# EAGLE design working (EAGLE 9.3.2)
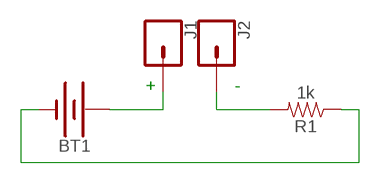
[diagram p0: schematic, sheet 1]

## Parts
BT1  BATTERY-20MM_SMD_4LEGS  [BATTCON_20MM_4LEGS]
J1  CONN_01  [1X01]
J2  CONN_01  [1X01]
R1  1k  1KOHM-HORIZ-1/4W-1%  [AXIAL-0.3]

## Nets
N$1: BT1.POSITIVE@1(+) BT1.POSITIVE@2(+) BT1.POSITIVE@3(+) BT1.POSITIVE@4(+) J1.1
N$2: J2.1 R1.P$2
N$3: BT1.NEGATIVE(-) R1.P$1

## Notes on the sheet
- + | -

## Library data of the parts
BT1 = SparkFun-Batteries:BATTERY: Battery - Single Cell A variety of battery chemistries, sizes, and footprints. Device List: 20MM_PTH - Coin Cell Battery Holder - 20mm (PTH) <https://www.sparkfun.com/products/783> 20MM_PTH_KIT- Coin Cell battery Holder - 20 mm (PTH) <http://www.sparkfun.com/products/783>kit version with special mask 6.8MM_PTH - Coin Cell Battery Holder - 6.8MM(SMD) <https://www.digikey.com/product-detail/en/seiko-instruments/MS621FE-FL11E/728-1057-ND/1889208?WT.srch=1&gclid=CNOQ5a6LzdQCFZS2wAodXCkE0g> 12MM_SMD - Coin Cell Battery Holder - 12mm (SMD) <https://www.sparkfun.com/products/10592> 12MM_PTH - Coin Cell Battery Holder - 12mm (PTH) <https://www.sparkfun.com/products/7948> 20MM_SMD - 20mm Coin Cell Battery Holder (SMD) (2 legs) Used on the Big Time Watch Kit <https://www.sparkfun.com/products/11734> 20MM_SMD_4LEGS - Coin Cell Battery Holder - 20mm (SMD) <https://www.sparkfun.com/products/11892> 20MM_SMD_4LEGS_OVERPASTE - Coin Cell Battery Holder - 20mm (SMD) <https://www.sparkfun.com/products/11892> (Over-paste on the legs) 24.5MM_PTH - Coin Cell Battery Holder - 24.5mm (PTH) <https://www.sparkfun.com/products/8863> 9V - 9V Battery Holder - PC Mount Used on the SparkFun SparkPunk Sound Kit <https://www.sparkfun.com/products/11177> and SparkFun SparkPunk Sequencer Kit <https://www.sparkfun.com/products/12707> 18650 - Battery Holder - 18650 (PTH) <https://www.sparkfun.com/products/13113> AA - Battery Holder - 1xAA (PTH) <https://www.sparkfun.com/products/7949> AAA - Battery Holder - 1xAAA (PTH) <https://www.sparkfun.com/products/12718> AA_KIT - Battery Holder - 1xAA (PTH) <https://www.sparkfun.com/products/7949> Special kit package - pads only have exposed copper on one side of the board. AAA_KIT - Battery Holder - 1xAAA (PTH) <https://www.sparkfun.com/products/12718> Special kit package - pads only have exposed copper on one side of the board.; PROD_ID: BATT-10373; SF_SKU: PRT-11892
J1 J2 = SparkFun-Connectors:CONN_01: Single connection point. Often used as Generic Header-pin footprint for 0.1 inch spaced/style header connections On any of the 0.1 inch spaced packages, you can populate with these: Break Away Headers - Straight <https://www.sparkfun.com/products/116> (PRT-00116) Break Away Male Headers - Right Angle <https://www.sparkfun.com/products/553> (PRT-00553) Female Headers <https://www.sparkfun.com/products/115> (PRT-00115) Break Away Headers - Machine Pin <https://www.sparkfun.com/products/117> (PRT-00117) Break Away Female Headers - Swiss Machine Pin <https://www.sparkfun.com/products/743> (PRT-00743) This device is also useful as a general connection point to wire up your design to another part of your project. Our various solder wires solder well into these plated through hole pads. Hook-Up Wire - Assortment (Stranded, 22 AWG) <https://www.sparkfun.com/products/11375> (PRT-11375) Hook-Up Wire - Assortment (Solid Core, 22 AWG) <https://www.sparkfun.com/products/11367> (PRT-11367) View the entire wire category on our website here <https://www.sparkfun.com/categories/141> Special notes: SMTSO-256-ET is a "flush mount" nut for a 4-40 screw. We mostly use this on specialty testbeds; it is a nice way to connect hardware to your PCB at an adjustable hieght. Also note, the SNAP packages are for using a snappable style connector. We sell a baggie of snaps and they are also used on two LilyPad designs: Snap Assortment - 30 pack (male and female) <https://www.sparkfun.com/products/11347> (DEV-11347) LilyPad Arduino SimpleSnap <https://www.sparkfun.com/products/10941> (DEV-10941) LilyPad SimpleSnap Protoboard <https://www.sparkfun.com/products/10940> (DEV-10940)
R1 = SparkFun-Resistors:1KOHM: 1kΩ resistor A resistor is a passive two-terminal electrical component that implements electrical resistance as a circuit element. Resistors act to reduce current flow, and, at the same time, act to lower voltage levels within circuits. - Wikipedia; PROD_ID: RES-12182

## Board
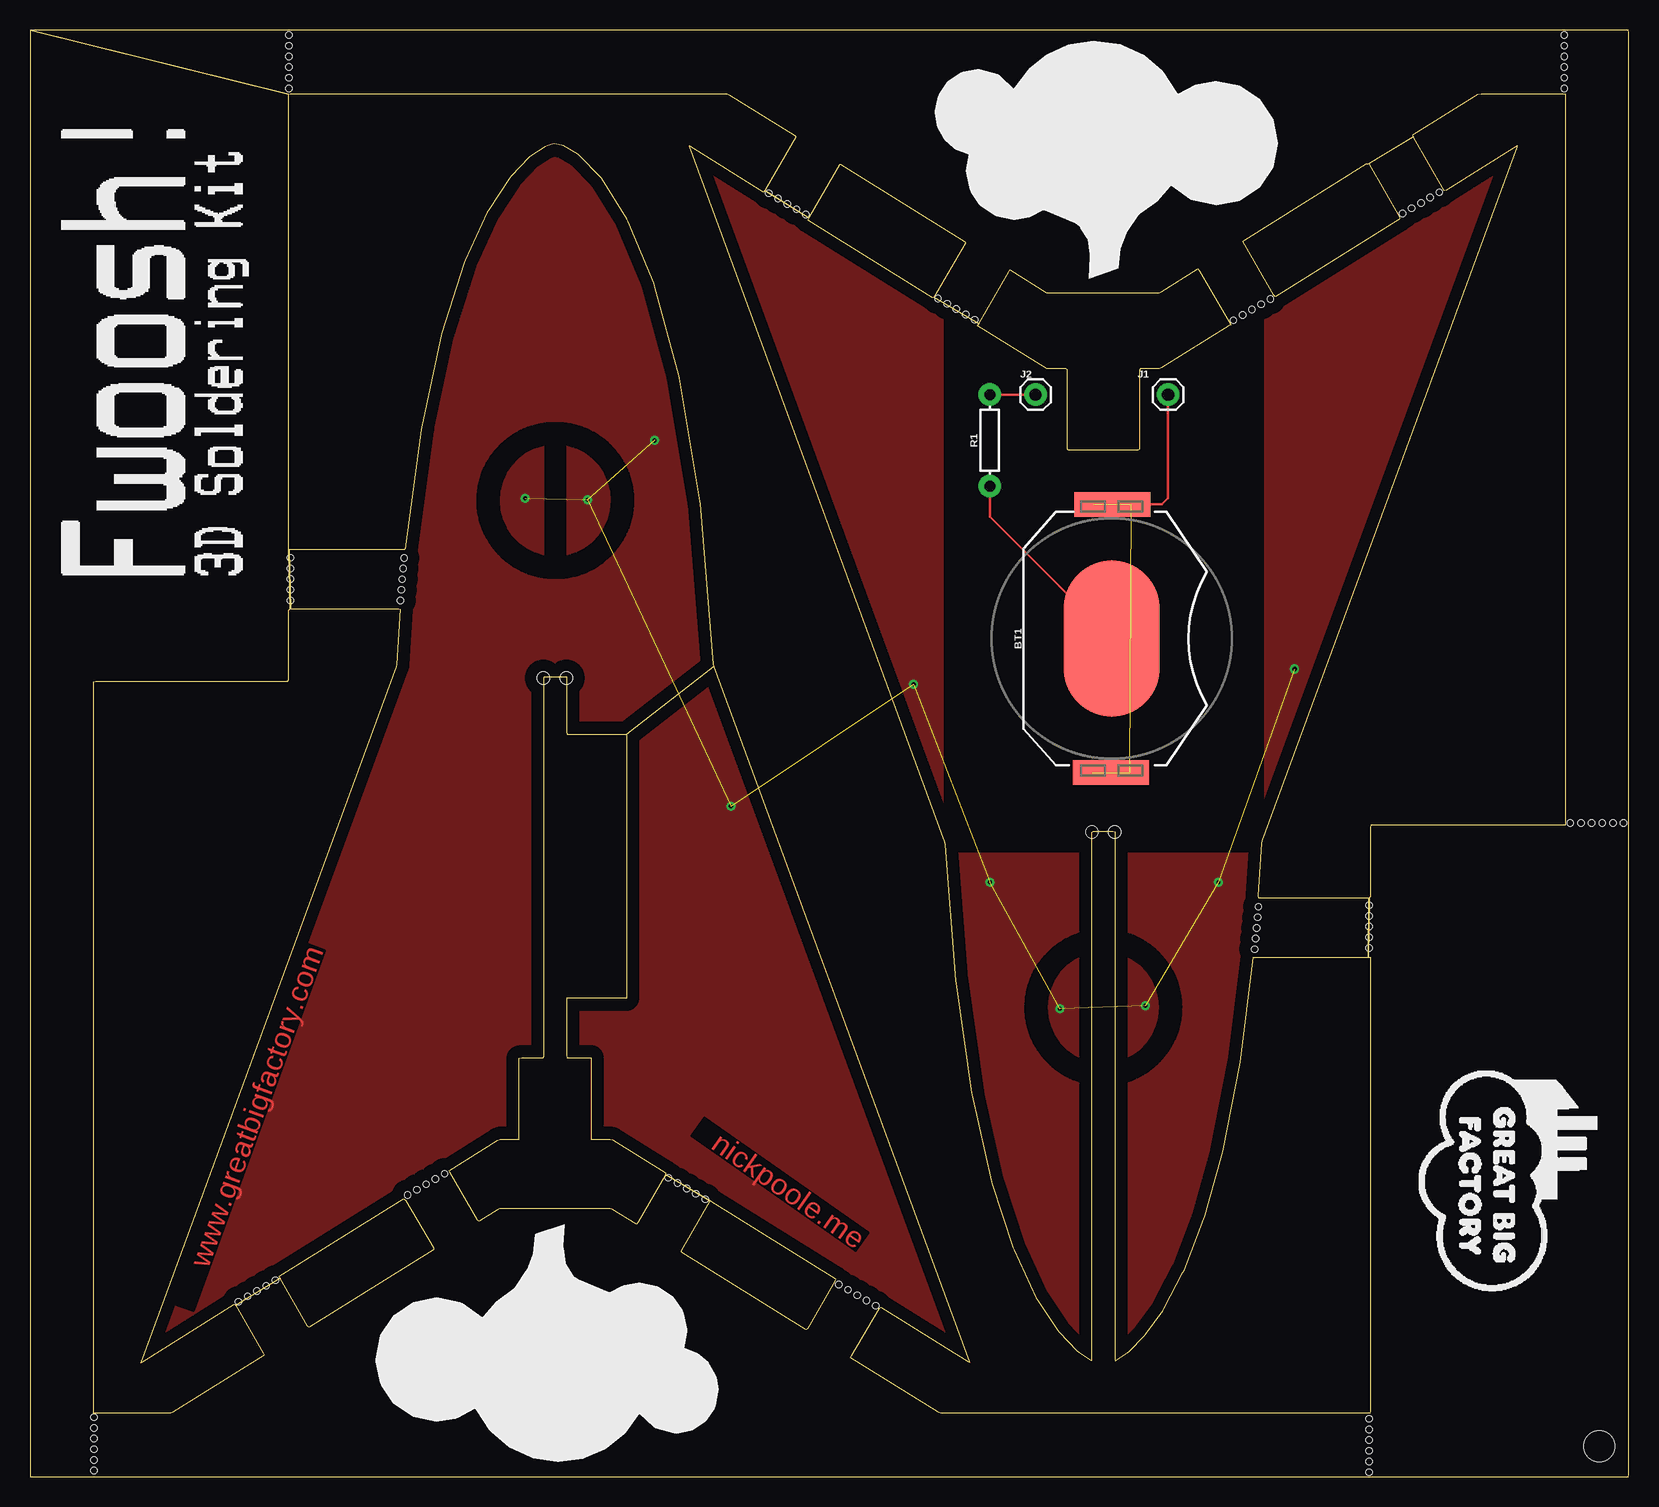
[diagram p1: board, top side]
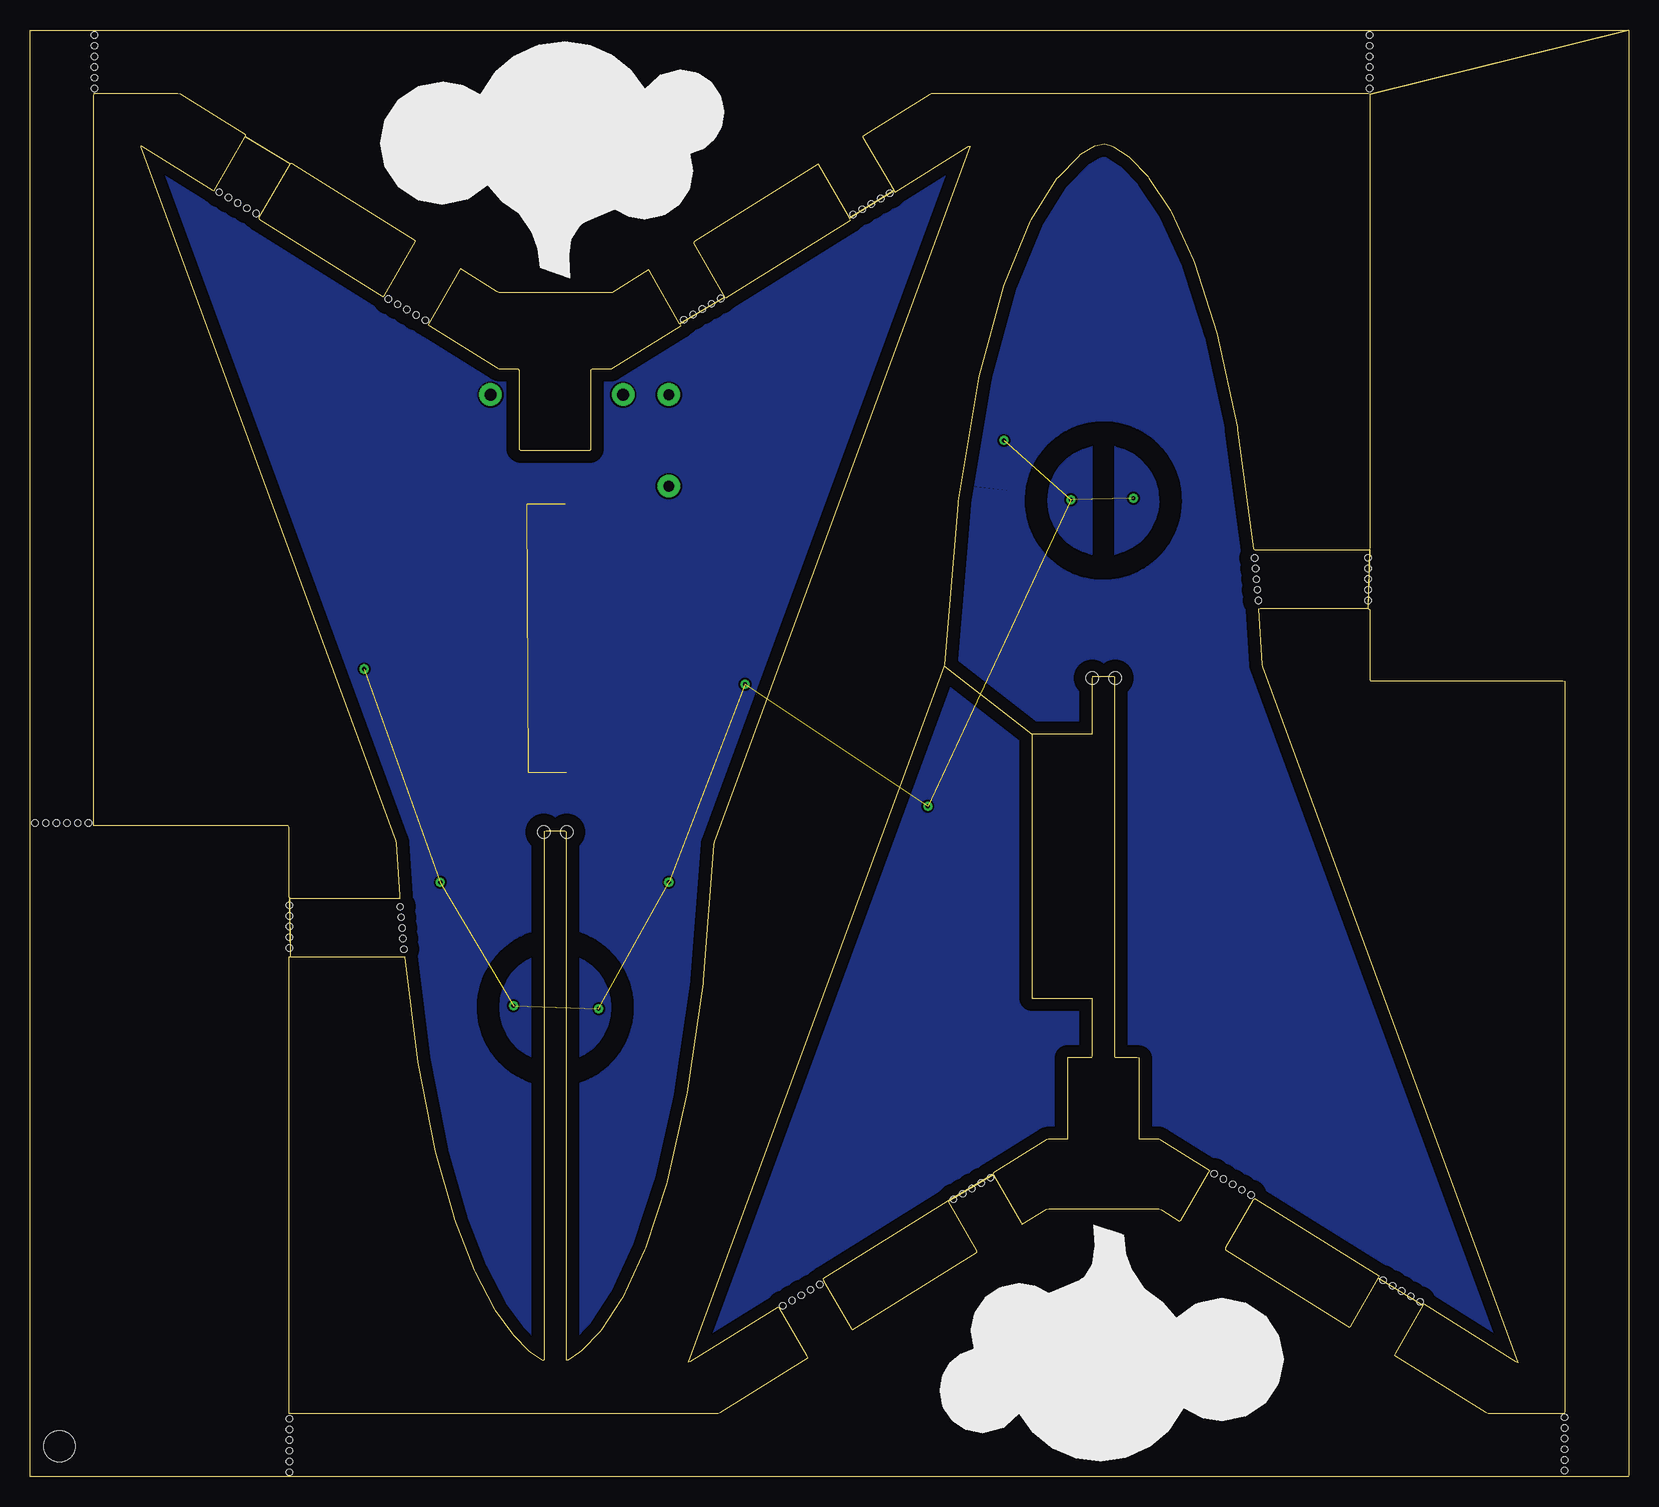
[diagram p2: board, bottom side, seen from below]

Size 133.26 x 120.56 mm. Coordinates in mm from the lower left corner, seen from the top.
Outline: 0,120.56 0,0.16 0.04,0 133.24,0 133.26,0.18 133.26,120.38 133.24,120.56 0.05,120.56 21.56,115.23 21.71,115.27 58.11,115.27 58.28,115.18 63.71,111.79 63.85,111.68 61.26,107.19 64.94,104.9 67.53,109.39 67.57,109.39 77.92,102.93 77.96,102.8 75.37,98.3 79.1,96.1 81.59,100.42 81.69,100.58 84.75,98.68 84.94,98.66 94.14,98.66 94.31,98.75 97.37,100.66 97.49,100.52 100.09,96.01 99.93,95.91 94.33,92.41 94.16,92.31 93.96,92.32 92.56,92.32 92.47,92.21 92.47,85.61 92.36,85.52 86.56,85.52 86.47,85.63 86.47,92.23 86.36,92.32 84.77,92.32 79,95.91 79.09,96.07 75.35,98.29 75.22,98.27 64.87,104.72 64.93,104.87 61.24,107.17 61.14,107.05 55.03,110.86 54.92,110.89 76.24,52.88 76.27,52.68 77.15,41.32 77.17,41.12 78.48,32.01 78.51,31.82 80.14,24.6 80.19,24.4 81.94,19.09 82.01,18.9 83.87,14.91 83.98,14.74 85.63,12.23 85.75,12.08 87.27,10.48 87.43,10.37 88.42,9.69 88.52,9.71 88.52,53.71 88.65,53.77 90.25,53.77 90.42,53.74 90.42,9.74 90.49,9.67 91.49,10.33 91.64,10.47 92.92,11.74 93.03,11.9 94.43,13.85 94.54,14.02 96.12,17.03 96.21,17.21 97.87,21.5 97.92,21.69 99.43,27.08 99.48,27.28 100.86,34.34 100.89,34.54 101.99,43.27 102.16,43.31 111.54,43.31 111.61,48.22 102.42,48.22 102.41,48.4 102.68,52.79 102.74,52.98 123.99,110.8 123.99,110.91 118.05,107.2 117.9,107.16 115.3,111.65 111.59,109.42 114.18,104.92 114.16,104.78 103.81,98.33 103.7,98.44 101.1,102.94 101.22,103.06 111.4,109.41 111.57,109.42 115.3,111.68 115.27,111.82 120.7,115.2 120.96,115.27 127.96,115.27 127.97,115.08 127.97,54.28 127.78,54.27 111.78,54.27 111.72,54.13 111.72,48.33 111.63,48.23 111.57,43.31 111.72,43.27 111.72,5.47 111.69,5.29 75.89,5.29 75.71,5.36 68.41,9.9 68.5,10.07 70.8,14.06 70.92,14.13 78.22,9.58 78.35,9.52 57.03,67.52 49.74,61.87 49.74,40.09 49.73,39.89 44.93,39.89 44.74,39.88 44.74,35.09 44.76,34.91 46.76,34.91 46.79,34.73 46.79,28.13 46.96,28.11 48.36,28.11 48.55,28.08 52.96,25.32 52.97,25.19 56.72,22.98 56.79,22.94 67.14,16.48 67.1,16.32 64.8,12.34 64.68,12.23 54.33,18.68 54.31,18.83 56.7,22.98 52.97,25.17 50.67,21.2 50.57,21.03 48.53,22.3 48.34,22.33 39.14,22.33 38.97,22.25 37.44,21.3 37.31,21.36 35.01,25.34 34.92,25.51 38.99,28.05 39.17,28.11 40.77,28.11 40.79,28.29 40.79,34.89 40.97,34.91 42.77,34.91 42.84,35.04 42.84,66.64 42.91,66.66 44.71,66.66 44.74,66.48 44.74,62.09 44.75,61.89 49.55,61.89 49.73,61.88 57.03,67.54 56.99,67.73 55.88,81.08 55.85,81.28 54.16,91.54 54.12,91.73 52.07,99.26 52.01,99.45 49.85,104.62 49.77,104.8 47.64,108.19 47.51,108.34 45.84,110.06 45.69,110.19 44.48,110.91 44.3,110.97 43.9,111.03 43.71,111.06 43.51,111.02 43.13,110.91 42.94,110.85 41.77,110.09 41.62,109.96 40.09,108.37 39.97,108.21 38.21,105.54 38.12,105.36 36.28,101.37 36.2,101.18 34.31,95.28 32.63,87.46 32.6,87.26 31.29,77.34 31.17,77.25 21.59,77.25 21.73,72.34 30.71,72.34 30.86,72.29 30.58,67.69 30.54,67.5 9.22,9.49 9.39,9.6 17.02,14.36 17.14,14.29 20.85,16.55 20.79,16.7 31.14,23.16 31.33,23.05 33.63,19.07 33.63,18.92 23.27,12.47 23.15,12.56 20.86,16.53 17.16,14.28 19.45,10.3 19.53,10.13 11.89,5.37 11.72,5.29 5.32,5.29 5.29,5.47 5.29,66.27 5.47,66.29 21.47,66.29 21.54,66.41 21.54,72.21 21.7,72.33 21.57,77.26 21.54,77.42 21.54,115.21 0.03,120.56 0,120.56
Copper layers (1*16): Top 0.035mm / dielectric 1.5mm / Bottom 0.035mm
Design rules "default": minimum track width 6mil, minimum drill 0.35mm, track to track 6mil, track to pad 6mil, pad to pad 6mil, via to via 6mil, smd to smd 6mil, copper to edge 40mil, drill to drill 6mil, minimum pad ring 10mil, minimum via ring 8mil, stop-mask expansion 4mil, vias tented up to drill 0mil, thermal gap 10mil
Holes 0.51 mm at 5.33,4.95 5.33,4.06 5.33,3.17 5.33,2.29 5.33,1.4 5.33,0.51 127.89,120.14 127.89,119.25 127.89,118.36 127.89,117.47 127.89,116.59 127.89,115.7 111.63,4.83 111.63,3.94 111.63,3.05 111.63,2.16 111.63,1.27 111.63,0.38 21.59,120.14 21.59,119.25 21.59,118.36 21.59,117.47 21.59,116.59 21.59,115.7 21.72,73.03 21.72,73.91 21.72,74.8 21.72,75.69 21.72,76.58 111.63,44.07 111.63,44.96 111.63,45.85 111.63,46.74 111.63,47.62 102.4,47.5 102.32,46.62 102.25,45.73 102.17,44.84 102.09,43.96 30.87,73.02 30.95,73.91 31.03,74.8 31.1,75.68 31.18,76.57 64.66,105.17 63.89,105.62 63.12,106.06 62.35,106.51 61.58,106.95 17.38,14.59 18.15,15.03 18.92,15.48 19.69,15.92 20.46,16.37 31.48,23.48 32.25,23.92 33.02,24.37 33.79,24.81 34.56,25.26 100.31,96.38 101.08,96.82 101.85,97.26 102.62,97.71 103.39,98.15 114.41,105.27 115.18,105.71 115.95,106.15 116.72,106.6 117.49,107.04 56.28,23.13 55.51,23.58 54.74,24.02 53.97,24.46 53.2,24.91 70.51,14.24 69.74,14.69 68.97,15.13 68.2,15.57 67.43,16.02 78.76,96.41 77.99,96.85 77.22,97.3 76.45,97.74 75.68,98.19 128.4,54.48 129.29,54.48 130.18,54.48 131.06,54.48 131.95,54.48 132.84,54.48
Holes 2.59 mm at 130.81,2.54
Holes 1.02 mm at 44.7,66.55 42.8,66.55 90.42,53.72 88.52,53.72

### Footprints (pad centres in the part's own frame; a part is rotated, then mirrored left to right if it is on the bottom)
BATTCON_20MM_4LEGS = smd 13 x 8: NEGATIVE 0,0 | smd 2.032 x 3.175: POSITIVE@1 -11.176,1.651; POSITIVE@2 -11.176,-1.524; POSITIVE@3 11.176,1.524; POSITIVE@4 11.176,-1.651
1X01 = drill 1.016 pad 1.88: 1 0,0
AXIAL-0.3 = drill 0.9 pad 1.88: P$1 -3.81,0; P$2 3.81,0

### Placement (x,y rotation side)
BT1  90.17,69.85 90 top
J1  94.87,90.17 0 top
J2  83.82,90.17 0 top
R1  80.01,86.36 90 top
U$1  [TEXT1466#PNG]  10.16,97.79 90 top
U$2  [GREATBIGFACTORYCLOUDLOGO#PNG]  123.19,24.51 270 top

### Tracks (layer width: path | path; a pad name or v marks a point on that pad's centre or on a via)
GND  (via drill 0.35)  (9 unrouted)
  other vias: 41.27,81.53 46.48,81.41 85.85,38.99 92.96,39.24 52.07,86.36 58.42,55.88 73.66,66.04 105.41,67.31 99.06,49.53 80.01,49.53
  pour Top (rank 3): 43.69,111.07 43.63,111.07 43.58,111.06 43.53,111.05 43.42,111.03 43.37,111.02 43.27,110.99 43.17,110.95 43.03,110.89 42.88,110.83 42.74,110.75 42.6,110.68 42.47,110.6 42.33,110.51 42.2,110.42 42.07,110.33 41.9,110.2 41.78,110.11 41.61,109.97 41.49,109.87 41.33,109.73 41.18,109.58 41.03,109.43 40.88,109.28 40.77,109.17 40.63,109.01 40.49,108.85 40.35,108.7 40.21,108.53 40.08,108.37 39.91,108.16 39.78,107.99 39.66,107.82 39.53,107.65 39.38,107.44 39.26,107.26 39.11,107.04 39,106.87 38.85,106.64 38.71,106.42 38.6,106.24 38.47,106.01 38.34,105.78 38.21,105.55 38.08,105.32 37.95,105.08 37.83,104.85 37.71,104.62 37.59,104.38 37.47,104.14 37.34,103.86 37.11,103.38 37,103.13 36.88,102.84 36.65,102.31 36.52,102.02 36.41,101.72 36.19,101.18 35.97,100.59 35.75,99.99 35.63,99.64 35.53,99.34 35.41,98.99 35.29,98.64 35.18,98.28 35.07,97.93 34.94,97.53 34.84,97.17 34.73,96.81 34.62,96.41 34.49,95.95 34.36,95.49 34.17,94.77 34.06,94.31 33.93,93.8 33.75,93.03 33.63,92.51 33.51,91.99 33.33,91.17 33.16,90.34 32.99,89.45 32.88,88.88 32.78,88.31 32.62,87.42 32.46,86.48 32.3,85.49 32.15,84.5 32.01,83.5 31.87,82.45 31.74,81.4 31.61,80.35 31.48,79.25 31.36,78.09 31.24,76.93 31.14,75.77 31.03,74.56 30.96,73.66 30.87,72.45 30.78,71.18 30.72,70.28 30.65,68.96 30.58,67.64 30.57,67.59 9.23,9.53 9.23,9.5 39.1,28.12 39.15,28.11 40.79,28.1 40.79,28.16 40.79,34.88 40.81,34.91 42.82,34.91 42.84,34.95 42.84,66.64 42.88,66.66 44.73,66.66 44.74,66.62 44.74,61.91 44.78,61.89 49.7,61.89 49.74,61.88 49.74,39.92 49.71,39.89 44.79,39.89 44.74,39.89 44.74,34.91 44.79,34.91 46.74,34.91 46.79,34.9 46.79,28.12 46.82,28.1 48.46,28.11 48.51,28.1 78.33,9.51 78.35,9.5 57.02,67.57 57,67.62 56.93,69.05 56.85,70.37 56.79,71.32 56.69,72.69 56.59,73.96 56.52,74.85 56.41,76.07 56.3,77.28 56.18,78.49 56.09,79.33 55.96,80.43 55.82,81.59 55.69,82.63 50.37,82.02 50.38,81.88 50.39,81.72 50.4,81.56 50.4,81.35 50.4,81.19 50.4,81.03 50.39,80.87 50.37,80.71 50.36,80.56 50.33,80.35 50.3,80.19 50.27,80.03 50.24,79.88 50.2,79.72 50.16,79.57 50.12,79.42 50.07,79.27 50.02,79.12 49.96,78.97 49.9,78.82 49.82,78.63 49.75,78.48 49.68,78.34 49.61,78.2 49.53,78.06 49.45,77.92 49.36,77.79 49.28,77.66 49.19,77.53 49.09,77.4 49,77.27 48.9,77.15 48.79,77.03 48.69,76.91 48.58,76.79 48.47,76.68 48.36,76.57 48.24,76.46 48.12,76.35 48,76.25 47.88,76.15 47.75,76.05 47.62,75.96 47.45,75.84 47.31,75.75 47.18,75.67 47.04,75.59 46.9,75.52 46.76,75.44 46.62,75.37 46.48,75.31 46.28,75.22 46.13,75.17 45.98,75.11 45.83,75.06 45.68,75.01 45.53,74.97 45.38,74.93 45.22,74.89 45.07,74.86 44.91,74.83 44.75,74.81 44.59,74.79 44.38,74.76 44.23,74.75 44.07,74.74 43.91,74.74 43.75,74.74 43.54,74.74 43.38,74.75 43.22,74.76 43.06,74.78 42.91,74.8 42.75,74.82 42.59,74.85 42.44,74.88 42.28,74.91 42.13,74.95 41.97,74.99 41.82,75.04 41.67,75.08 41.52,75.14 41.37,75.19 41.23,75.25 41.08,75.32 40.94,75.38 40.79,75.45 40.65,75.53 40.51,75.6 40.38,75.68 40.24,75.77 40.11,75.86 39.94,75.98 39.81,76.07 39.68,76.17 39.56,76.27 39.44,76.37 39.32,76.48 39.2,76.58 39.09,76.7 38.94,76.85 38.84,76.97 38.73,77.09 38.63,77.21 38.53,77.33 38.44,77.46 38.35,77.59 38.26,77.72 38.17,77.86 38.09,77.99 38.01,78.13 37.94,78.27 37.86,78.41 37.79,78.55 37.73,78.7 37.67,78.84 37.61,78.99 37.55,79.14 37.5,79.29 37.45,79.44 37.41,79.59 37.37,79.75 37.33,79.9 37.3,80.06 37.27,80.21 37.25,80.37 37.23,80.53 37.21,80.69 37.19,80.84 37.18,81.05 37.18,81.21 37.17,81.37 37.18,81.53 37.18,81.69 37.2,81.9 37.21,82.06 37.23,82.22 37.25,82.37 37.28,82.53 37.31,82.69 37.34,82.84 37.38,83 37.42,83.15 37.47,83.3 37.51,83.45 37.57,83.6 37.62,83.75 37.68,83.9 37.74,84.04 37.81,84.19 37.88,84.33 37.95,84.47 38.03,84.61 38.11,84.75 38.19,84.88 38.28,85.02 38.37,85.15 38.46,85.28 38.56,85.4 38.66,85.53 38.76,85.65 38.86,85.77 38.97,85.89 39.12,86.04 39.23,86.15 39.35,86.26 39.47,86.36 39.59,86.46 39.71,86.56 39.84,86.66 39.97,86.75 40.14,86.87 40.28,86.96 40.41,87.04 40.55,87.12 40.69,87.2 40.83,87.27 40.97,87.34 41.12,87.4 41.26,87.47 41.41,87.53 41.56,87.58 41.71,87.63 41.86,87.68 42.01,87.73 42.17,87.77 42.32,87.8 42.47,87.84 42.63,87.87 42.79,87.89 42.94,87.91 43.16,87.94 43.31,87.95 43.47,87.96 43.63,87.97 43.79,87.97 43.81,87.97 43.97,87.96 44.13,87.96 44.34,87.94 44.5,87.93 44.66,87.91 44.82,87.89 44.97,87.86 45.13,87.83 45.28,87.8 45.44,87.76 45.59,87.72 45.74,87.67 45.89,87.63 46.04,87.57 46.19,87.52 46.34,87.46 46.49,87.39 46.63,87.33 46.77,87.26 46.91,87.18 47.05,87.11 47.19,87.03 47.32,86.94 47.46,86.86 47.59,86.77 47.72,86.68 47.84,86.58 47.97,86.48 48.09,86.38 48.21,86.27 48.33,86.17 48.48,86.02 48.62,85.87 48.73,85.75 48.84,85.63 48.94,85.51 49.03,85.38 49.13,85.26 49.22,85.13 49.31,84.99 49.4,84.86 49.48,84.73 49.56,84.59 49.64,84.45 49.71,84.31 49.78,84.17 49.84,84.02 49.91,83.87 49.96,83.73 50.02,83.58 50.07,83.43 50.12,83.28 50.16,83.12 50.2,82.97 50.24,82.82 50.27,82.66 50.3,82.51 50.33,82.35 50.35,82.19 50.37,82.05 55.68,82.65 55.53,83.74 55.38,84.79 55.24,85.73 55.17,86.15 55.07,86.77 54.91,87.71 54.73,88.7 54.56,89.59 54.39,90.47 54.21,91.35 54.03,92.18 53.9,92.75 53.83,93.06 53.64,93.83 53.45,94.6 53.33,95.06 53.24,95.42 53.12,95.83 53,96.28 52.87,96.74 52.76,97.1 52.66,97.45 52.52,97.91 52.39,98.31 52.28,98.66 52.16,99.02 52.04,99.37 51.84,99.97 51.73,100.27 51.6,100.61 51.49,100.91 51.38,101.21 51.26,101.5 51.14,101.8 51.02,102.09 50.9,102.39 50.67,102.92 50.54,103.21 50.43,103.45 50.3,103.74 50.18,103.98 50.05,104.26 49.93,104.5 49.81,104.74 49.69,104.97 49.56,105.2 49.43,105.44 49.31,105.67 49.17,105.9 49.04,106.13 48.9,106.35 48.77,106.58 48.62,106.8 48.48,107.02 48.36,107.2 48.21,107.42 48.09,107.59 47.94,107.81 47.81,107.98 47.65,108.19 47.52,108.35 47.35,108.56 47.21,108.72 47.07,108.88 46.93,109.04 46.79,109.19 46.64,109.34 46.49,109.49 46.34,109.64 46.18,109.78 46.06,109.89 45.9,110.02 45.78,110.12 45.61,110.25 45.49,110.35 45.31,110.47 45.18,110.56 45.04,110.64 44.91,110.72 44.77,110.79 44.62,110.86 44.48,110.92 44.38,110.96 44.28,111 44.23,111.01 44.12,111.04 44.02,111.06 43.97,111.07 43.92,111.07 43.86,111.07 43.81,111.05 43.77,111.06 43.71,111.07
  pour Top (rank 3): 54.9,110.94 76.26,52.83 76.32,51.61 76.39,50.45 76.46,49.34 76.54,48.18 76.62,47.07 76.67,46.38 76.72,45.75 76.82,44.59 76.92,43.54 77.03,42.43 77.09,41.85 77.16,41.22 77.27,40.22 77.39,39.28 77.5,38.33 77.58,37.75 77.66,37.18 77.79,36.23 77.87,35.71 77.95,35.13 78.09,34.25 78.18,33.72 78.27,33.2 78.43,32.26 78.6,31.33 78.69,30.86 78.79,30.34 78.95,29.56 79.05,29.1 79.15,28.63 79.25,28.17 79.35,27.75 79.51,27.03 79.61,26.62 79.73,26.16 79.83,25.75 79.94,25.34 80.05,24.93 80.16,24.52 80.27,24.11 80.39,23.7 80.49,23.35 80.61,22.94 80.72,22.59 80.83,22.24 80.94,21.88 81.07,21.48 81.17,21.18 81.29,20.83 81.47,20.33 81.67,19.78 81.88,19.24 82.07,18.75 82.29,18.21 82.52,17.67 82.71,17.24 82.93,16.75 83.13,16.32 83.35,15.9 83.47,15.66 83.59,15.43 83.81,15.01 84.05,14.59 84.18,14.36 84.29,14.18 84.51,13.82 84.74,13.47 84.86,13.29 84.97,13.11 85.09,12.94 85.22,12.77 85.34,12.6 85.47,12.43 85.6,12.26 85.73,12.09 85.86,11.93 86,11.77 86.1,11.65 86.24,11.49 86.35,11.37 86.49,11.21 86.6,11.1 86.75,10.95 86.9,10.8 87.02,10.7 87.18,10.55 87.3,10.45 87.42,10.35 87.55,10.25 87.67,10.15 87.8,10.06 87.93,9.97 88.06,9.88 88.2,9.8 88.34,9.72 88.48,9.65 88.52,9.63 88.52,32.54 88.49,32.57 88.33,32.6 88.17,32.62 87.97,32.67 87.81,32.71 87.66,32.75 87.56,32.78 87.41,32.83 87.31,32.86 87.21,32.89 87.06,32.95 86.91,33.01 86.77,33.07 86.62,33.14 86.53,33.19 86.39,33.26 86.25,33.33 86.11,33.41 86.02,33.47 85.88,33.55 85.75,33.64 85.62,33.73 85.49,33.83 85.41,33.89 85.28,33.99 85.16,34.09 85.08,34.16 84.97,34.27 84.85,34.38 84.74,34.49 84.67,34.57 84.56,34.68 84.45,34.8 84.35,34.92 84.28,35.01 84.19,35.13 84.09,35.26 84,35.39 83.94,35.48 83.86,35.61 83.78,35.75 83.72,35.84 83.65,35.98 83.57,36.12 83.5,36.26 83.46,36.35 83.39,36.5 83.33,36.65 83.27,36.79 83.22,36.94 83.19,37.04 83.14,37.2 83.09,37.35 83.05,37.5 83.03,37.6 82.99,37.76 82.96,37.92 82.94,38.07 82.91,38.23 82.9,38.39 82.88,38.49 82.87,38.65 82.86,38.81 82.86,38.97 82.86,39.13 82.86,39.28 82.86,39.44 82.88,39.6 82.88,39.71 82.9,39.86 82.91,39.97 82.94,40.13 82.96,40.28 82.99,40.44 83.03,40.59 83.06,40.75 83.09,40.85 83.12,40.95 83.17,41.1 83.22,41.26 83.27,41.4 83.33,41.55 83.37,41.65 83.43,41.8 83.5,41.94 83.57,42.08 83.62,42.18 83.69,42.32 83.77,42.45 83.85,42.59 83.91,42.68 84,42.81 84.09,42.94 84.18,43.07 84.28,43.2 84.38,43.32 84.48,43.44 84.59,43.56 84.7,43.67 84.77,43.75 84.88,43.86 85,43.97 85.08,44.04 85.2,44.15 85.32,44.25 85.44,44.34 85.53,44.41 85.66,44.5 85.79,44.59 85.92,44.68 86.01,44.73 86.15,44.82 86.28,44.89 86.42,44.97 86.52,45.02 86.66,45.09 86.81,45.15 86.95,45.21 87.1,45.27 87.2,45.31 87.35,45.36 87.45,45.4 87.6,45.44 87.7,45.47 87.86,45.51 88.01,45.55 88.17,45.58 88.32,45.61 88.48,45.64 88.52,45.66 88.52,53.75 88.55,53.77 90.4,53.77 90.42,53.74 90.42,45.69 90.43,45.64 90.63,45.61 90.84,45.57 90.95,45.55 91.1,45.51 91.3,45.45 91.51,45.39 91.71,45.32 91.81,45.29 91.95,45.23 92.15,45.15 92.34,45.06 92.48,44.99 92.58,44.94 92.76,44.84 92.94,44.73 93.12,44.61 93.3,44.49 93.47,44.37 93.55,44.3 93.68,44.2 93.84,44.07 93.99,43.93 94.07,43.85 94.18,43.74 94.33,43.59 94.47,43.43 94.61,43.27 94.67,43.18 94.77,43.06 94.89,42.89 95.01,42.71 95.1,42.58 95.15,42.49 95.26,42.3 95.36,42.12 95.43,41.98 95.47,41.88 95.56,41.69 95.64,41.49 95.71,41.29 95.76,41.14 95.81,40.99 95.87,40.79 95.91,40.63 95.95,40.43 95.98,40.27 96.02,40.06 96.04,39.9 96.05,39.75 96.07,39.53 96.08,39.38 96.08,39.16 96.08,38.95 96.08,38.79 96.07,38.64 96.05,38.43 96.03,38.27 96,38.06 95.97,37.9 95.93,37.69 95.9,37.54 95.84,37.33 95.8,37.18 95.75,37.03 95.68,36.83 95.62,36.68 95.54,36.49 95.48,36.34 95.41,36.2 95.31,36.01 95.24,35.87 95.13,35.69 95.02,35.51 94.93,35.38 94.84,35.25 94.74,35.12 94.61,34.95 94.51,34.83 94.37,34.67 94.26,34.56 94.15,34.44 94,34.29 93.89,34.19 93.73,34.05 93.56,33.91 93.44,33.82 93.31,33.72 93.18,33.63 93.04,33.55 92.86,33.43 92.73,33.35 92.59,33.28 92.4,33.18 92.26,33.11 92.11,33.05 91.92,32.97 91.72,32.89 91.57,32.84 91.42,32.79 91.21,32.73 91.01,32.68 90.8,32.63 90.65,32.6 90.44,32.57 90.42,32.53 90.42,9.67 90.43,9.63 90.52,9.68 90.66,9.75 90.8,9.83 90.93,9.92 91.06,10.01 91.19,10.1 91.32,10.19 91.45,10.29 91.57,10.39 91.69,10.49 91.81,10.6 91.97,10.74 92.08,10.85 92.23,11 92.46,11.22 92.57,11.34 92.71,11.5 92.85,11.66 92.95,11.78 93.09,11.94 93.22,12.1 93.35,12.27 93.48,12.44 93.61,12.61 93.73,12.78 93.85,12.95 93.97,13.12 94.09,13.3 94.21,13.48 94.44,13.83 94.66,14.19 94.77,14.38 94.9,14.61 95.13,15.02 95.36,15.44 95.48,15.67 95.6,15.91 95.81,16.34 96.02,16.77 96.24,17.25 96.43,17.68 96.66,18.22 96.88,18.76 97.07,19.25 97.18,19.55 97.29,19.84 97.47,20.34 97.65,20.84 97.77,21.19 97.87,21.49 98,21.9 98.11,22.25 98.22,22.6 98.33,22.96 98.45,23.36 98.56,23.72 98.67,24.12 98.79,24.53 98.9,24.94 99.01,25.35 99.11,25.76 99.22,26.17 99.33,26.63 99.43,27.04 99.6,27.77 99.69,28.18 99.79,28.64 99.89,29.11 99.99,29.58 100.15,30.35 100.25,30.87 100.34,31.34 100.44,31.86 100.53,32.38 100.68,33.22 100.76,33.74 100.85,34.26 100.99,35.15 101.07,35.67 101.15,36.25 101.29,37.19 101.36,37.77 101.44,38.34 101.56,39.29 101.67,40.23 101.79,41.29 101.85,41.87 101.92,42.55 102.02,43.55 102.12,44.6 102.21,45.66 102.3,46.71 102.38,47.82 102.46,48.93 102.53,50.09 102.6,51.25 102.64,52.05 102.68,52.79 102.69,52.84 124.03,110.9 124.03,110.93 94.17,92.31 94.12,92.31 92.48,92.32 92.47,92.28 92.47,85.56 92.45,85.52 86.47,85.52 86.47,85.57 86.47,92.29 86.45,92.32 84.81,92.31 84.76,92.32
  pour Top (rank 3): 44.74,85.87 44.74,76.87 44.76,76.85 45.47,77.06 45.52,77.08 46.18,77.41 46.23,77.44 46.82,77.88 46.86,77.92 47.37,78.45 47.79,79.06 47.82,79.11 48.13,79.78 48.14,79.83 48.33,80.55 48.4,81.34 48.4,81.39 48.34,82.13 48.33,82.18 48.14,82.9 48.12,82.95 47.81,83.62 47.39,84.23 47.36,84.27 46.85,84.81 46.81,84.84 46.21,85.28 45.55,85.61 45.5,85.64 44.74,85.87
  pour Top (rank 3): 42.79,85.85 42.08,85.63 42.03,85.61 41.37,85.28 40.77,84.84 40.73,84.8 40.22,84.27 40.19,84.23 39.77,83.61 39.46,82.94 39.44,82.89 39.25,82.18 39.24,82.12 39.18,81.39 39.18,81.33 39.25,80.54 39.44,79.83 39.45,79.78 39.76,79.11 39.79,79.06 40.2,78.45 40.72,77.91 40.76,77.88 41.35,77.44 41.4,77.41 42.06,77.08 42.11,77.06 42.82,76.85 42.84,76.87 42.84,85.86
  pour Top (rank 3): 90.42,43.62 90.42,34.62 90.45,34.6 91.16,34.82 91.21,34.84 91.87,35.17 91.92,35.2 92.51,35.64 93.03,36.18 93.06,36.22 93.48,36.83 93.5,36.88 93.81,37.55 94,38.27 94.02,38.32 94.08,39.11 94.02,39.9 93.81,40.67 93.5,41.34 93.48,41.39 93.06,42 93.02,42.04 92.55,42.54 92.51,42.57 91.91,43.01 91.87,43.04 91.21,43.38 91.16,43.39 90.45,43.61
  pour Top (rank 3): 88.49,43.61 87.78,43.39 87.73,43.37 87.07,43.04 87.03,43.01 86.43,42.57 86.39,42.53 85.92,42.04 85.88,42 85.46,41.38 85.44,41.34 85.13,40.66 84.94,39.95 84.93,39.9 84.86,39.11 84.93,38.31 84.94,38.26 85.13,37.55 85.44,36.87 85.46,36.83 85.88,36.21 85.91,36.17 86.43,35.64 87.02,35.2 87.07,35.17 87.73,34.84 87.78,34.82 88.49,34.6 88.52,34.61 88.52,43.61
  cutout Top (rank 3): 76.2,97.79 76.2,52.07 102.87,52.07 102.87,97.79
GND1
  pour Bottom (rank 3): 43.69,111.07 43.63,111.07 43.58,111.06 43.53,111.05 43.42,111.03 43.37,111.02 43.27,110.99 43.17,110.95 43.03,110.89 42.88,110.83 42.74,110.75 42.6,110.68 42.47,110.6 42.33,110.51 42.2,110.42 42.07,110.33 41.9,110.2 41.78,110.11 41.61,109.97 41.49,109.87 41.33,109.73 41.18,109.58 41.03,109.43 40.88,109.28 40.77,109.17 40.63,109.01 40.49,108.85 40.35,108.7 40.21,108.53 40.08,108.37 39.91,108.16 39.78,107.99 39.66,107.82 39.53,107.65 39.38,107.44 39.26,107.26 39.11,107.04 39,106.87 38.85,106.64 38.71,106.42 38.6,106.24 38.47,106.01 38.34,105.78 38.21,105.55 38.08,105.32 37.95,105.08 37.83,104.85 37.71,104.62 37.59,104.38 37.47,104.14 37.34,103.86 37.11,103.38 37,103.13 36.88,102.84 36.65,102.31 36.52,102.02 36.41,101.72 36.19,101.18 35.97,100.59 35.75,99.99 35.63,99.64 35.53,99.34 35.41,98.99 35.29,98.64 35.18,98.28 35.07,97.93 34.94,97.53 34.84,97.17 34.73,96.81 34.62,96.41 34.49,95.95 34.36,95.49 34.17,94.77 34.06,94.31 33.93,93.8 33.75,93.03 33.63,92.51 33.51,91.99 33.33,91.17 33.16,90.34 32.99,89.45 32.88,88.88 32.78,88.31 32.62,87.42 32.46,86.48 32.3,85.49 32.15,84.5 32.01,83.5 31.87,82.45 31.74,81.4 31.61,80.35 31.48,79.25 31.36,78.09 31.24,76.93 31.14,75.77 31.03,74.56 30.96,73.66 30.87,72.45 30.78,71.18 30.72,70.28 30.65,68.96 30.58,67.64 30.57,67.59 9.23,9.53 9.23,9.5 39.1,28.12 39.15,28.11 40.79,28.1 40.79,28.16 40.79,34.88 40.81,34.91 42.82,34.91 42.84,34.95 42.84,66.64 42.88,66.66 44.73,66.66 44.74,66.62 44.74,61.91 44.78,61.89 49.7,61.89 49.74,61.88 49.74,39.92 49.71,39.89 44.79,39.89 44.74,39.89 44.74,34.91 44.79,34.91 46.74,34.91 46.79,34.9 46.79,28.12 46.82,28.1 48.46,28.11 48.51,28.1 78.33,9.51 78.35,9.5 57.02,67.57 57,67.62 56.93,69.05 56.85,70.37 56.79,71.32 56.69,72.69 56.59,73.96 56.52,74.85 56.41,76.07 56.3,77.28 56.18,78.49 56.09,79.33 55.96,80.43 55.82,81.59 55.69,82.63 50.37,82.02 50.38,81.88 50.39,81.72 50.4,81.56 50.4,81.35 50.4,81.19 50.4,81.03 50.39,80.87 50.37,80.71 50.36,80.56 50.33,80.35 50.3,80.19 50.27,80.03 50.24,79.88 50.2,79.72 50.16,79.57 50.12,79.42 50.07,79.27 50.02,79.12 49.96,78.97 49.9,78.82 49.82,78.63 49.75,78.48 49.68,78.34 49.61,78.2 49.53,78.06 49.45,77.92 49.36,77.79 49.28,77.66 49.19,77.53 49.09,77.4 49,77.27 48.9,77.15 48.79,77.03 48.69,76.91 48.58,76.79 48.47,76.68 48.36,76.57 48.24,76.46 48.12,76.35 48,76.25 47.88,76.15 47.75,76.05 47.62,75.96 47.45,75.84 47.31,75.75 47.18,75.67 47.04,75.59 46.9,75.52 46.76,75.44 46.62,75.37 46.48,75.31 46.28,75.22 46.13,75.17 45.98,75.11 45.83,75.06 45.68,75.01 45.53,74.97 45.38,74.93 45.22,74.89 45.07,74.86 44.91,74.83 44.75,74.81 44.59,74.79 44.38,74.76 44.23,74.75 44.07,74.74 43.91,74.74 43.75,74.74 43.54,74.74 43.38,74.75 43.22,74.76 43.06,74.78 42.91,74.8 42.75,74.82 42.59,74.85 42.44,74.88 42.28,74.91 42.13,74.95 41.97,74.99 41.82,75.04 41.67,75.08 41.52,75.14 41.37,75.19 41.23,75.25 41.08,75.32 40.94,75.38 40.79,75.45 40.65,75.53 40.51,75.6 40.38,75.68 40.24,75.77 40.11,75.86 39.94,75.98 39.81,76.07 39.68,76.17 39.56,76.27 39.44,76.37 39.32,76.48 39.2,76.58 39.09,76.7 38.94,76.85 38.84,76.97 38.73,77.09 38.63,77.21 38.53,77.33 38.44,77.46 38.35,77.59 38.26,77.72 38.17,77.86 38.09,77.99 38.01,78.13 37.94,78.27 37.86,78.41 37.79,78.55 37.73,78.7 37.67,78.84 37.61,78.99 37.55,79.14 37.5,79.29 37.45,79.44 37.41,79.59 37.37,79.75 37.33,79.9 37.3,80.06 37.27,80.21 37.25,80.37 37.23,80.53 37.21,80.69 37.19,80.84 37.18,81.05 37.18,81.21 37.17,81.37 37.18,81.53 37.18,81.69 37.2,81.9 37.21,82.06 37.23,82.22 37.25,82.37 37.28,82.53 37.31,82.69 37.34,82.84 37.38,83 37.42,83.15 37.47,83.3 37.51,83.45 37.57,83.6 37.62,83.75 37.68,83.9 37.74,84.04 37.81,84.19 37.88,84.33 37.95,84.47 38.03,84.61 38.11,84.75 38.19,84.88 38.28,85.02 38.37,85.15 38.46,85.28 38.56,85.4 38.66,85.53 38.76,85.65 38.86,85.77 38.97,85.89 39.12,86.04 39.23,86.15 39.35,86.26 39.47,86.36 39.59,86.46 39.71,86.56 39.84,86.66 39.97,86.75 40.14,86.87 40.28,86.96 40.41,87.04 40.55,87.12 40.69,87.2 40.83,87.27 40.97,87.34 41.12,87.4 41.26,87.47 41.41,87.53 41.56,87.58 41.71,87.63 41.86,87.68 42.01,87.73 42.17,87.77 42.32,87.8 42.47,87.84 42.63,87.87 42.79,87.89 42.94,87.91 43.16,87.94 43.31,87.95 43.47,87.96 43.63,87.97 43.79,87.97 43.81,87.97 43.97,87.96 44.13,87.96 44.34,87.94 44.5,87.93 44.66,87.91 44.82,87.89 44.97,87.86 45.13,87.83 45.28,87.8 45.44,87.76 45.59,87.72 45.74,87.67 45.89,87.63 46.04,87.57 46.19,87.52 46.34,87.46 46.49,87.39 46.63,87.33 46.77,87.26 46.91,87.18 47.05,87.11 47.19,87.03 47.32,86.94 47.46,86.86 47.59,86.77 47.72,86.68 47.84,86.58 47.97,86.48 48.09,86.38 48.21,86.27 48.33,86.17 48.48,86.02 48.62,85.87 48.73,85.75 48.84,85.63 48.94,85.51 49.03,85.38 49.13,85.26 49.22,85.13 49.31,84.99 49.4,84.86 49.48,84.73 49.56,84.59 49.64,84.45 49.71,84.31 49.78,84.17 49.84,84.02 49.91,83.87 49.96,83.73 50.02,83.58 50.07,83.43 50.12,83.28 50.16,83.12 50.2,82.97 50.24,82.82 50.27,82.66 50.3,82.51 50.33,82.35 50.35,82.19 50.37,82.05 55.68,82.65 55.53,83.74 55.38,84.79 55.24,85.73 55.17,86.15 55.07,86.77 54.91,87.71 54.73,88.7 54.56,89.59 54.39,90.47 54.21,91.35 54.03,92.18 53.9,92.75 53.83,93.06 53.64,93.83 53.45,94.6 53.33,95.06 53.24,95.42 53.12,95.83 53,96.28 52.87,96.74 52.76,97.1 52.66,97.45 52.52,97.91 52.39,98.31 52.28,98.66 52.16,99.02 52.04,99.37 51.84,99.97 51.73,100.27 51.6,100.61 51.49,100.91 51.38,101.21 51.26,101.5 51.14,101.8 51.02,102.09 50.9,102.39 50.67,102.92 50.54,103.21 50.43,103.45 50.3,103.74 50.18,103.98 50.05,104.26 49.93,104.5 49.81,104.74 49.69,104.97 49.56,105.2 49.43,105.44 49.31,105.67 49.17,105.9 49.04,106.13 48.9,106.35 48.77,106.58 48.62,106.8 48.48,107.02 48.36,107.2 48.21,107.42 48.09,107.59 47.94,107.81 47.81,107.98 47.65,108.19 47.52,108.35 47.35,108.56 47.21,108.72 47.07,108.88 46.93,109.04 46.79,109.19 46.64,109.34 46.49,109.49 46.34,109.64 46.18,109.78 46.06,109.89 45.9,110.02 45.78,110.12 45.61,110.25 45.49,110.35 45.31,110.47 45.18,110.56 45.04,110.64 44.91,110.72 44.77,110.79 44.62,110.86 44.48,110.92 44.38,110.96 44.28,111 44.23,111.01 44.12,111.04 44.02,111.06 43.97,111.07 43.92,111.07 43.86,111.07 43.81,111.05 43.77,111.06 43.71,111.07
  pour Bottom (rank 3): 54.9,110.94 76.26,52.83 76.32,51.61 76.39,50.45 76.46,49.34 76.54,48.18 76.62,47.07 76.67,46.38 76.72,45.75 76.82,44.59 76.92,43.54 77.03,42.43 77.09,41.85 77.16,41.22 77.27,40.22 77.39,39.28 77.5,38.33 77.58,37.75 77.66,37.18 77.79,36.23 77.87,35.71 77.95,35.13 78.09,34.25 78.18,33.72 78.27,33.2 78.43,32.26 78.6,31.33 78.69,30.86 78.79,30.34 78.95,29.56 79.05,29.1 79.15,28.63 79.25,28.17 79.35,27.75 79.51,27.03 79.61,26.62 79.73,26.16 79.83,25.75 79.94,25.34 80.05,24.93 80.16,24.52 80.27,24.11 80.39,23.7 80.49,23.35 80.61,22.94 80.72,22.59 80.83,22.24 80.94,21.88 81.07,21.48 81.17,21.18 81.29,20.83 81.47,20.33 81.67,19.78 81.88,19.24 82.07,18.75 82.29,18.21 82.52,17.67 82.71,17.24 82.93,16.75 83.13,16.32 83.35,15.9 83.47,15.66 83.59,15.43 83.81,15.01 84.05,14.59 84.18,14.36 84.29,14.18 84.51,13.82 84.74,13.47 84.86,13.29 84.97,13.11 85.09,12.94 85.22,12.77 85.34,12.6 85.47,12.43 85.6,12.26 85.73,12.09 85.86,11.93 86,11.77 86.1,11.65 86.24,11.49 86.35,11.37 86.49,11.21 86.6,11.1 86.75,10.95 86.9,10.8 87.02,10.7 87.18,10.55 87.3,10.45 87.42,10.35 87.55,10.25 87.67,10.15 87.8,10.06 87.93,9.97 88.06,9.88 88.2,9.8 88.34,9.72 88.48,9.65 88.52,9.63 88.52,32.54 88.49,32.57 88.33,32.6 88.17,32.62 87.97,32.67 87.81,32.71 87.66,32.75 87.56,32.78 87.41,32.83 87.31,32.86 87.21,32.89 87.06,32.95 86.91,33.01 86.77,33.07 86.62,33.14 86.53,33.19 86.39,33.26 86.25,33.33 86.11,33.41 86.02,33.47 85.88,33.55 85.75,33.64 85.62,33.73 85.49,33.83 85.41,33.89 85.28,33.99 85.16,34.09 85.08,34.16 84.97,34.27 84.85,34.38 84.74,34.49 84.67,34.57 84.56,34.68 84.45,34.8 84.35,34.92 84.28,35.01 84.19,35.13 84.09,35.26 84,35.39 83.94,35.48 83.86,35.61 83.78,35.75 83.72,35.84 83.65,35.98 83.57,36.12 83.5,36.26 83.46,36.35 83.39,36.5 83.33,36.65 83.27,36.79 83.22,36.94 83.19,37.04 83.14,37.2 83.09,37.35 83.05,37.5 83.03,37.6 82.99,37.76 82.96,37.92 82.94,38.07 82.91,38.23 82.9,38.39 82.88,38.49 82.87,38.65 82.86,38.81 82.86,38.97 82.86,39.13 82.86,39.28 82.86,39.44 82.88,39.6 82.88,39.71 82.9,39.86 82.91,39.97 82.94,40.13 82.96,40.28 82.99,40.44 83.03,40.59 83.06,40.75 83.09,40.85 83.12,40.95 83.17,41.1 83.22,41.26 83.27,41.4 83.33,41.55 83.37,41.65 83.43,41.8 83.5,41.94 83.57,42.08 83.62,42.18 83.69,42.32 83.77,42.45 83.85,42.59 83.91,42.68 84,42.81 84.09,42.94 84.18,43.07 84.28,43.2 84.38,43.32 84.48,43.44 84.59,43.56 84.7,43.67 84.77,43.75 84.88,43.86 85,43.97 85.08,44.04 85.2,44.15 85.32,44.25 85.44,44.34 85.53,44.41 85.66,44.5 85.79,44.59 85.92,44.68 86.01,44.73 86.15,44.82 86.28,44.89 86.42,44.97 86.52,45.02 86.66,45.09 86.81,45.15 86.95,45.21 87.1,45.27 87.2,45.31 87.35,45.36 87.45,45.4 87.6,45.44 87.7,45.47 87.86,45.51 88.01,45.55 88.17,45.58 88.32,45.61 88.48,45.64 88.52,45.66 88.52,53.75 88.55,53.77 90.4,53.77 90.42,53.74 90.42,45.69 90.43,45.64 90.63,45.61 90.84,45.57 90.95,45.55 91.1,45.51 91.3,45.45 91.51,45.39 91.71,45.32 91.81,45.29 91.95,45.23 92.15,45.15 92.34,45.06 92.48,44.99 92.58,44.94 92.76,44.84 92.94,44.73 93.12,44.61 93.3,44.49 93.47,44.37 93.55,44.3 93.68,44.2 93.84,44.07 93.99,43.93 94.07,43.85 94.18,43.74 94.33,43.59 94.47,43.43 94.61,43.27 94.67,43.18 94.77,43.06 94.89,42.89 95.01,42.71 95.1,42.58 95.15,42.49 95.26,42.3 95.36,42.12 95.43,41.98 95.47,41.88 95.56,41.69 95.64,41.49 95.71,41.29 95.76,41.14 95.81,40.99 95.87,40.79 95.91,40.63 95.95,40.43 95.98,40.27 96.02,40.06 96.04,39.9 96.05,39.75 96.07,39.53 96.08,39.38 96.08,39.16 96.08,38.95 96.08,38.79 96.07,38.64 96.05,38.43 96.03,38.27 96,38.06 95.97,37.9 95.93,37.69 95.9,37.54 95.84,37.33 95.8,37.18 95.75,37.03 95.68,36.83 95.62,36.68 95.54,36.49 95.48,36.34 95.41,36.2 95.31,36.01 95.24,35.87 95.13,35.69 95.02,35.51 94.93,35.38 94.84,35.25 94.74,35.12 94.61,34.95 94.51,34.83 94.37,34.67 94.26,34.56 94.15,34.44 94,34.29 93.89,34.19 93.73,34.05 93.56,33.91 93.44,33.82 93.31,33.72 93.18,33.63 93.04,33.55 92.86,33.43 92.73,33.35 92.59,33.28 92.4,33.18 92.26,33.11 92.11,33.05 91.92,32.97 91.72,32.89 91.57,32.84 91.42,32.79 91.21,32.73 91.01,32.68 90.8,32.63 90.65,32.6 90.44,32.57 90.42,32.53 90.42,9.67 90.43,9.63 90.52,9.68 90.66,9.75 90.8,9.83 90.93,9.92 91.06,10.01 91.19,10.1 91.32,10.19 91.45,10.29 91.57,10.39 91.69,10.49 91.81,10.6 91.97,10.74 92.08,10.85 92.23,11 92.46,11.22 92.57,11.34 92.71,11.5 92.85,11.66 92.95,11.78 93.09,11.94 93.22,12.1 93.35,12.27 93.48,12.44 93.61,12.61 93.73,12.78 93.85,12.95 93.97,13.12 94.09,13.3 94.21,13.48 94.44,13.83 94.66,14.19 94.77,14.38 94.9,14.61 95.13,15.02 95.36,15.44 95.48,15.67 95.6,15.91 95.81,16.34 96.02,16.77 96.24,17.25 96.43,17.68 96.66,18.22 96.88,18.76 97.07,19.25 97.18,19.55 97.29,19.84 97.47,20.34 97.65,20.84 97.77,21.19 97.87,21.49 98,21.9 98.11,22.25 98.22,22.6 98.33,22.96 98.45,23.36 98.56,23.72 98.67,24.12 98.79,24.53 98.9,24.94 99.01,25.35 99.11,25.76 99.22,26.17 99.33,26.63 99.43,27.04 99.6,27.77 99.69,28.18 99.79,28.64 99.89,29.11 99.99,29.58 100.15,30.35 100.25,30.87 100.34,31.34 100.44,31.86 100.53,32.38 100.68,33.22 100.76,33.74 100.85,34.26 100.99,35.15 101.07,35.67 101.15,36.25 101.29,37.19 101.36,37.77 101.44,38.34 101.56,39.29 101.67,40.23 101.79,41.29 101.85,41.87 101.92,42.55 102.02,43.55 102.12,44.6 102.21,45.66 102.3,46.71 102.38,47.82 102.46,48.93 102.53,50.09 102.6,51.25 102.64,52.05 102.68,52.79 102.69,52.84 124.03,110.9 124.03,110.93 94.17,92.31 94.12,92.31 92.48,92.32 92.47,92.28 92.47,85.56 92.45,85.52 86.47,85.52 86.47,85.57 86.47,92.29 86.45,92.32 84.81,92.31 84.76,92.32
  pour Bottom (rank 3): 44.74,85.87 44.74,76.87 44.76,76.85 45.47,77.06 45.52,77.08 46.18,77.41 46.23,77.44 46.82,77.88 46.86,77.92 47.37,78.45 47.79,79.06 47.82,79.11 48.13,79.78 48.14,79.83 48.33,80.55 48.4,81.34 48.4,81.39 48.34,82.13 48.33,82.18 48.14,82.9 48.12,82.95 47.81,83.62 47.39,84.23 47.36,84.27 46.85,84.81 46.81,84.84 46.21,85.28 45.55,85.61 45.5,85.64 44.74,85.87
  pour Bottom (rank 3): 42.79,85.85 42.08,85.63 42.03,85.61 41.37,85.28 40.77,84.84 40.73,84.8 40.22,84.27 40.19,84.23 39.77,83.61 39.46,82.94 39.44,82.89 39.25,82.18 39.24,82.12 39.18,81.39 39.18,81.33 39.25,80.54 39.44,79.83 39.45,79.78 39.76,79.11 39.79,79.06 40.2,78.45 40.72,77.91 40.76,77.88 41.35,77.44 41.4,77.41 42.06,77.08 42.11,77.06 42.82,76.85 42.84,76.87 42.84,85.86
  pour Bottom (rank 3): 90.42,43.62 90.42,34.62 90.45,34.6 91.16,34.82 91.21,34.84 91.87,35.17 91.92,35.2 92.51,35.64 93.03,36.18 93.06,36.22 93.48,36.83 93.5,36.88 93.81,37.55 94,38.27 94.02,38.32 94.08,39.11 94.02,39.9 93.81,40.67 93.5,41.34 93.48,41.39 93.06,42 93.02,42.04 92.55,42.54 92.51,42.57 91.91,43.01 91.87,43.04 91.21,43.38 91.16,43.39 90.45,43.61
  pour Bottom (rank 3): 88.49,43.61 87.78,43.39 87.73,43.37 87.07,43.04 87.03,43.01 86.43,42.57 86.39,42.53 85.92,42.04 85.88,42 85.46,41.38 85.44,41.34 85.13,40.66 84.94,39.95 84.93,39.9 84.86,39.11 84.93,38.31 84.94,38.26 85.13,37.55 85.44,36.87 85.46,36.83 85.88,36.21 85.91,36.17 86.43,35.64 87.02,35.2 87.07,35.17 87.73,34.84 87.78,34.82 88.49,34.6 88.52,34.61 88.52,43.61
N$1  (3 unrouted)
  Top 0.203: J1.1 94.87,81.53 94.36,81.03 BT1.POSITIVE@4
N$2
  Top 0.203: R1.P$2 J2.1
N$3
  Top 0.203: BT1.NEGATIVE 80.01,80.01 R1.P$1

### Text on the board
Top: www.greatbigfactory.com | nickpoole.me